# EAGLE schematic preampli (EAGLE 7.2.0)
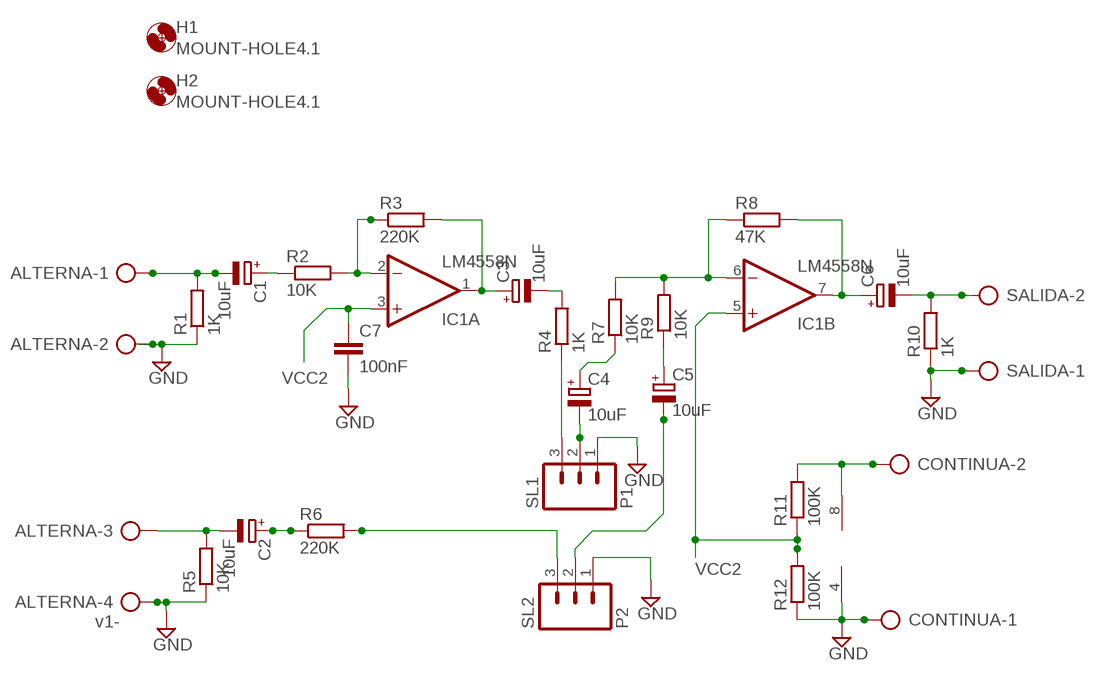
[diagram p0: schematic, sheet 1]

## Parts
ALTERNA  v1-  AK500/4  [AK500/4]
C1  10uF  CPOL-EUE2,5-6E  [E2,5-6E]
C2  10uF  CPOL-EUE2,5-6E  [E2,5-6E]
C3  10uF  CPOL-EUE2,5-6E  [E2,5-6E]
C4  10uF  CPOL-EUE2,5-6E  [E2,5-6E]
C5  10uF  CPOL-EUE2,5-6E  [E2,5-6E]
C6  10uF  CPOL-EUE2,5-6E  [E2,5-6E]
C7  100nF  C-EU025-025X050  [C025-025X050]
CONTINUA  AK500/2  [AK500/2]
H1  MOUNT-HOLE4.1  [4,1]
H2  MOUNT-HOLE4.1  [4,1]
IC1  LM4558N  [DIL08]
R1  1K  R-EU_0207/10  [0207/10]
R2  10K  R-EU_0207/10  [0207/10]
R3  220K  R-EU_0207/10  [0207/10]
R4  1K  R-EU_0207/10  [0207/10]
R5  10K  R-EU_0207/10  [0207/10]
R6  220K  R-EU_0207/10  [0207/10]
R7  10K  R-EU_0207/10  [0207/10]
R8  47K  R-EU_0207/10  [0207/10]
R9  10K  R-EU_0207/10  [0207/10]
R10  1K  R-EU_0207/10  [0207/10]
R11  100K  R-EU_0207/10  [0207/10]
R12  100K  R-EU_0207/10  [0207/10]
SALIDA  AK500/2  [AK500/2]
SL1  P1  MA03  [03P]
SL2  P2  MA03  [03P]

## Nets
GND: ALTERNA.2 ALTERNA.4 C7.2 CONTINUA.1 IC1.4(P:V-) R1.1 R5.1 R10.1 R12.1 SALIDA.1 SL1.1 SL2.1
N$1: ALTERNA.3 C2.- R5.2
N$2: R4.1 SL1.3
N$4: C1.+ R2.1
N$5: IC1.2(A:-IN) R2.2 R3.1
N$6: C2.+ R6.1
N$7: CONTINUA.2 IC1.8(P:V+) R11.2
N$8: C4.- SL1.2
N$9: R6.2 SL2.3
N$10: C3.- R4.2
N$11: C3.+ IC1.1(A:OUT) R3.2
N$12: C5.- SL2.2
N$13: C5.+ R9.1
N$14: C4.+ R7.1
N$15: IC1.6(B:-IN) R7.2 R8.1 R9.2
N$17: C6.- R10.2 SALIDA.2
N$18: C6.+ IC1.7(B:OUT) R8.2
V1+: ALTERNA.1 C1.- R1.2
VCC2: C7.1 IC1.3(A:+IN) IC1.5(B:+IN) R11.1 R12.2

## Library data of the parts
ALTERNA = con-ptr500:AK500/4: CONNECTOR; OC_FARNELL: unknown; OC_NEWARK: unknown
C1-C6 = rcl:CPOL-EU: POLARIZED CAPACITOR, European symbol
C7 = rcl:C-EU: CAPACITOR, European symbol
CONTINUA SALIDA = con-ptr500:AK500/2: CONNECTOR; OC_FARNELL: unknown; OC_NEWARK: unknown
H1 H2 = holes:MOUNT-HOLE: MOUNTING HOLE with drill center marker
IC1 = linear:*4558: OP AMP
R1-R10 = rcl:R-EU_: RESISTOR, European symbol
R11 R12 = resistor:R-EU_: RESISTOR, European symbol
SL1 SL2 = con-amp-quick:MA03: AMP QUICK CONNECTOR; OC_FARNELL: unknown; OC_NEWARK: unknown